# Altium schematic sheet Connectors.SchDoc
size A; SheetNumber: 2; SheetTotal: 3
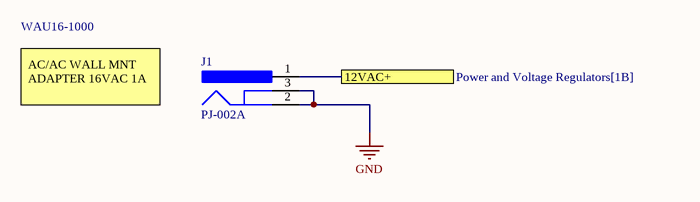
[diagram p0: Connectors.SchDoc]

## Parts
J1  PJ-002A  [CUI-PJ-002A_V]

## Ports
12VAC+ (see Power and Voltage Regulators[1B])

## Nets
GND: J1.2 J1.3
12VAC+: J1.1 ; port 12VAC+

## Notes on the sheet
- WAU16-1000
- AC/AC WALL MNT ADAPTER 16VAC 1A

## Library data of the parts
J1 = PJ-002A: CONN PWR JACK 2X5.5MM SOLDER; Manufacturer: CUIInc.; Connector Type: DCPowerJack; Brand: CUI; Inside Contact Diameter: 2mm; Voltage Rating: 24V; Mounting Angle: Right; Outside Contact Diameter: 6.5mm; Current Rating: 2.5A; Insulation Resistance: 50MOhms; Description: 12V, 1A, 2mm Dia; Option: General Purpose; Rated Current (Power): 1A; DIN Conformance: No; Contact Gender: Male; Datasheet Version: Rev. 1.03, 04/2016; Housing Material: PolybutyleneTerephthalate(PBT); Operating Temperature Range: -25Cto+85C; Termination Style: ThroughHole; Product Category: DCPowerConnectors; Mounting Technology: ThroughHole; Mounting Style: ThroughHole; Factory Pack Quantity: 500; Contact Plating: Nickel; Package Reference: PJ-002A; Package Description: 3-Pin Through Hole Device, Body 14.4 x 9 mm, Height 11 mm; Flammability Rating: UL94V-0; Manufacturer URL: http://www.cui.com/; Product: Jacks; Contact Material: Copper; Datasheet URL: http://www.cui.com/product/resource/pj-002a.pdf; RoHS: True; Supplier: Mouser; Supplier Part Number: 490-PJ-002A; Manufacturer Part Number: PJ-002A; Category: Uncategorized; Contact Finish - Mating: NOT SPECIFIED; Body/Shell Style: JACK; Termination: Solder; Pin Diameter: 2mm; Reach SVHC Compliant: Yes; RoHS Compliant: Yes; IEC Conformance: No; MIL Conformance: No; ComponentLink1URL: https://datasheet.ciiva.com:443/pdfs/VipMasterIC/IC/CUIS/CUIS-S-A0007606357/CUIS-S-A0007606357-1.pdf?src-supplier=IHS+Markit; ComponentLink1Description: https://datasheet.ciiva.com:443/pdfs/VipMasterIC/IC/CUIS/CUIS-S-A0007606357/CUIS-S-A0007606357-1.pdf?src-supplier=IHS+Markit; ComponentLink2URL: http://www.mouser.com/ds/2/670/pj-002a-515880.pdf?src-supplier=Mouser; ComponentLink2Description: http://www.mouser.com/ds/2/670/pj-002a-515880.pdf?src-supplier=Mouser; ComponentLink3URL: https://www.cui.com/product/resource/digikeypdf/pj-002a.pdf?src-supplier=Digikey; ComponentLink3Description: https://www.cui.com/product/resource/digikeypdf/pj-002a.pdf?src-supplier=Digikey; ComponentLink4URL: http://www.cui.com/Product/Resource/FuturePDF/PJ-002A.pdf?src-supplier=Future+Electronics; ComponentLink4Description: http://www.cui.com/Product/Resource/FuturePDF/PJ-002A.pdf?src-supplier=Future+Electronics